# EAGLE design shrew-programmer (EAGLE 7.6.0)
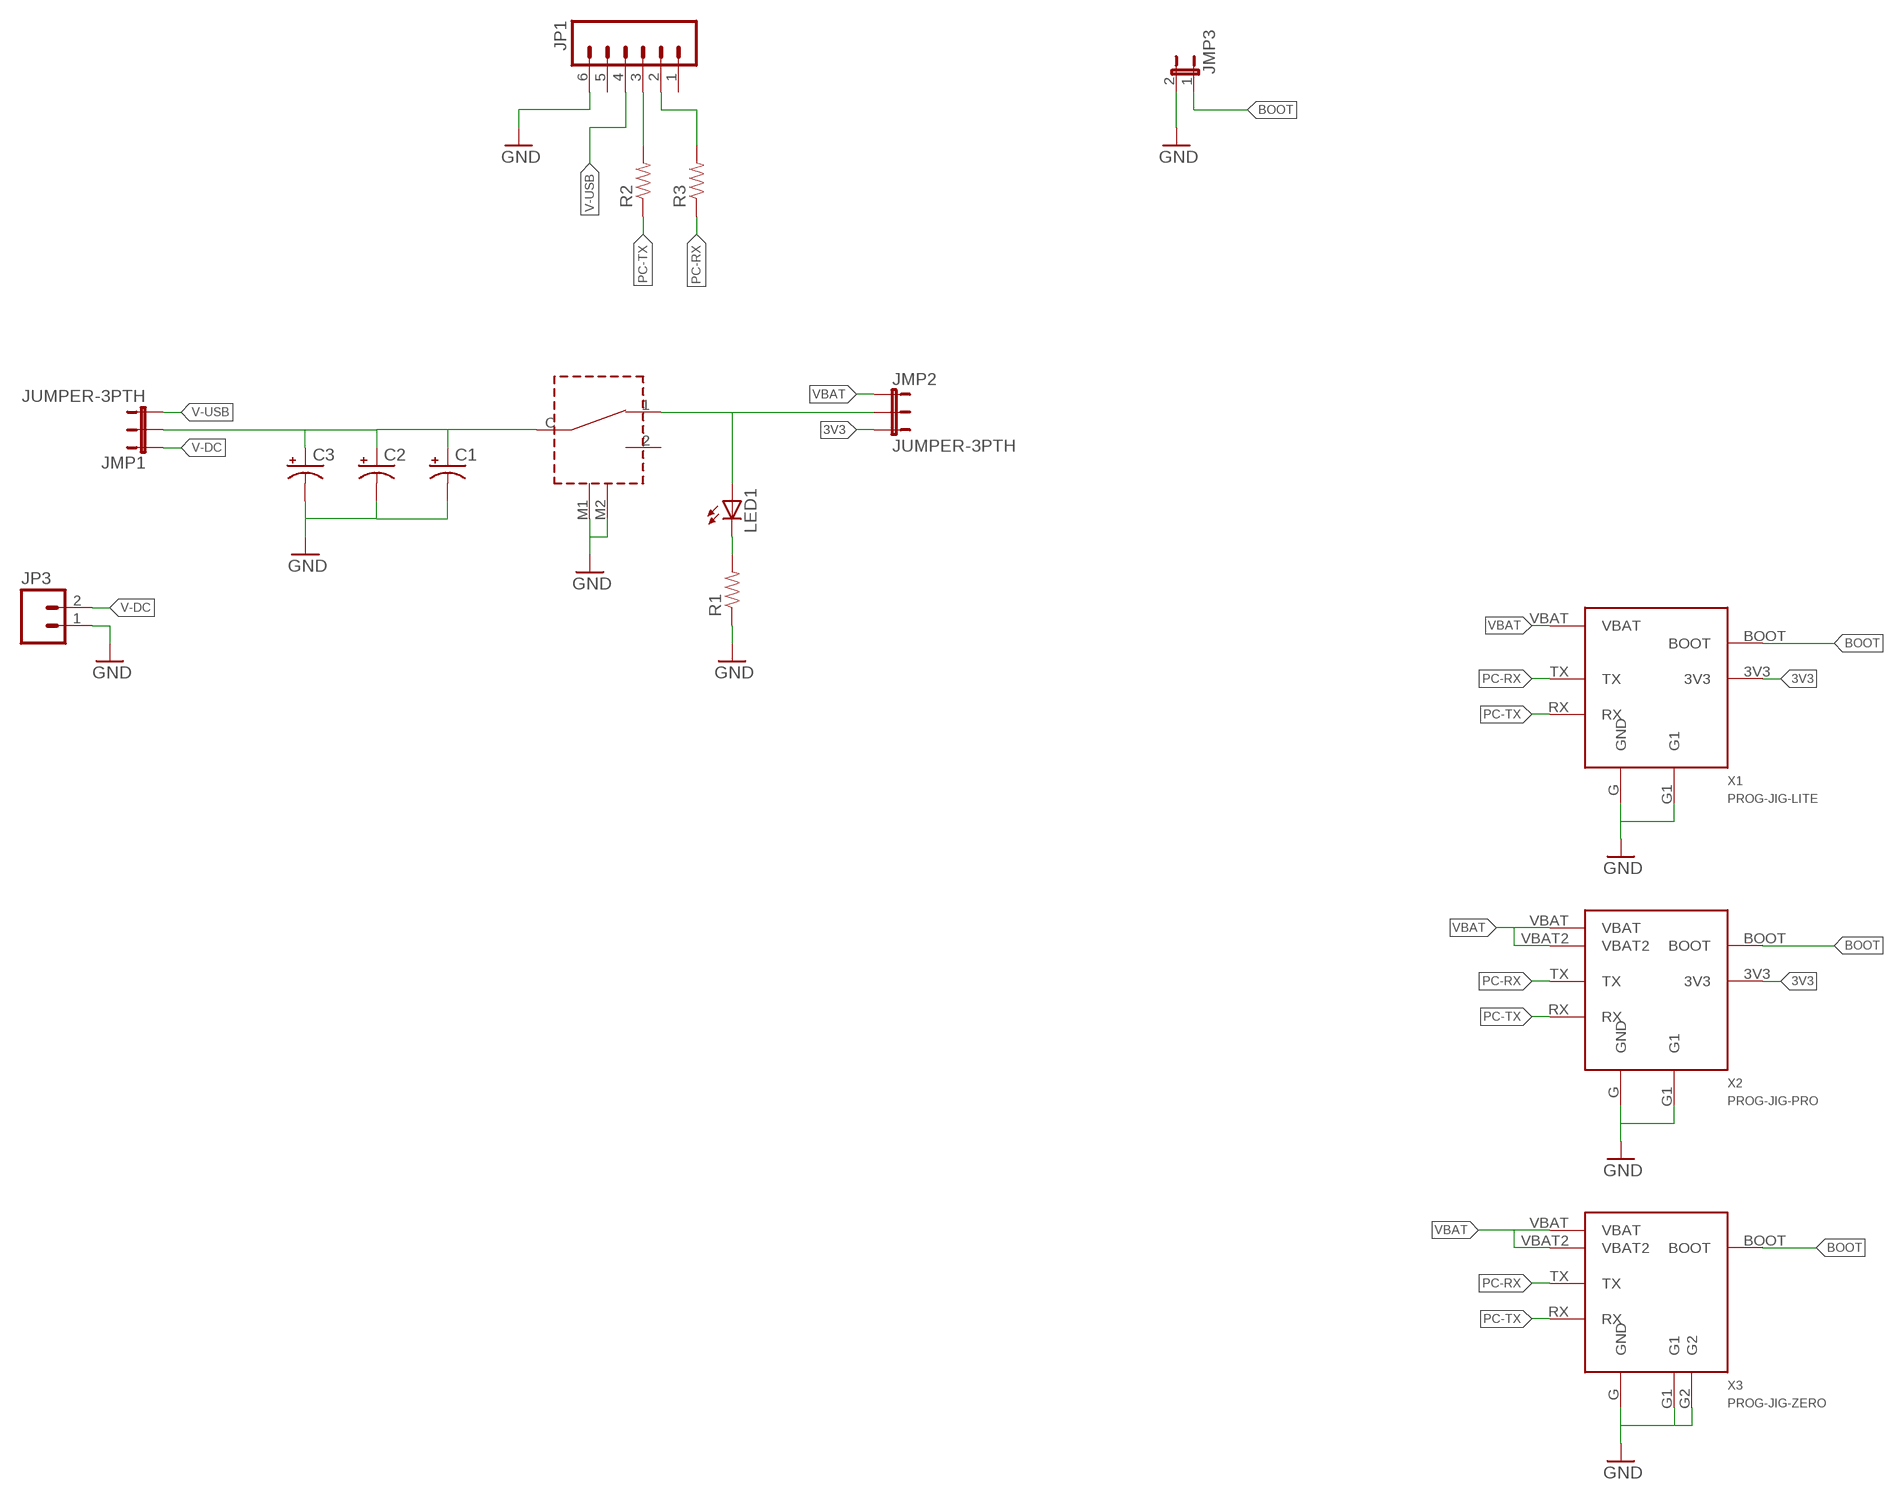
[diagram p0: schematic, sheet 1]

## Parts
C1  CAP_POLPTH1  [CPOL-RADIAL-100UF-25V]
C2  CAP_POLPTH1  [CPOL-RADIAL-100UF-25V]
C3  CAP_POLPTH1  [CPOL-RADIAL-100UF-25V]
JMP1  JUMPER-3PTH  [1X03]
JMP2  JUMPER-3PTH  [1X03]
JMP3  JUMPER-2PTH  [1X02]
JP1  M06LONGPADS  [1X06_LONGPADS]
JP3  M023.5MM  [SCREWTERMINAL-3.5MM-2]
LED1  LED1206  [LED-1206]
R1  RESISTOR0603-RES  [0603-RES]
R2  RESISTOR0603-RES  [0603-RES]
R3  RESISTOR0603-RES  [0603-RES]
SW1  SWITCH-ROCKER-3PIN-2MNT  [SWITCH-ROCKER-3PIN-2MNT]
X1  PROG-JIG-LITE  [PROG-JIG-LITE]
X2  PROG-JIG-PRO  [PROG-JIG-PRO]
X3  PROG-JIG-ZERO  [PROG-JIG-ZERO]

## Nets
3V3: JMP2.3 X1.3V3 X2.3V3
BOOT: JMP3.1 X1.BOOT X2.BOOT X3.BOOT
GND: C1.2(-) C2.2(-) C3.2(-) JMP3.2 JP1.6 JP3.1 R1.1 SW1.M1 SW1.M2 X1.G1 X1.G(GND) X2.G1 X2.G(GND) X3.G1 X3.G2 X3.G(GND)
N$1: JP1.3 R2.2
N$2: JP1.2 R3.2
N$4: C1.1(+) C2.1(+) C3.1(+) JMP1.2 SW1.C
N$5: LED1.C R1.2
N$6: JMP2.2 LED1.A SW1.1
PC-RX: R3.1 X1.TX X2.TX X3.TX
PC-TX: R2.1 X1.RX X2.RX X3.RX
V-DC: JMP1.1 JP3.2
V-USB: JMP1.3 JP1.4
VBAT: JMP2.1 X1.VBAT X2.VBAT X2.VBAT2 X3.VBAT X3.VBAT2
Unconnected: JP1.1 JP1.5 SW1.2

## Library data of the parts
C1-C3 = shrew-common:CAP_POL: Capacitor Polarized These are standard SMD and PTH capacitors. Normally 10uF, 47uF, and 100uF in electrolytic and tantalum varieties. Always verify the external diameter of the through hole cap, it varies with capacity, voltage, and manufacturer. The EIA devices should be standard.
JMP1 JMP2 = shrew-common:JUMPER-3
JMP3 = shrew-common:JUMPER-2: Jumper Basic 0.1" spaced jumper. Use with breakaway headers.
JP1 = shrew-common:M06: Header 6 Standard 6-pin 0.1" header. Use with straight break away headers (SKU : PRT-00116), right angle break away headers (PRT-00553), swiss pins (PRT-00743), machine pins (PRT-00117), and female headers (PRT-00115). Molex polarized connector foot print use with SKU : PRT-08094 with associated crimp pins and housings. NOTES ON THE VARIANTS LOCK and LOCK_LONGPADS... This footprint was designed to help hold the alignment of a through-hole component (i.e. 6-pin header) while soldering it into place. You may notice that each hole has been shifted either up or down by 0.005 of an inch from it's more standard position (which is a perfectly straight line). This slight alteration caused the pins (the squares in the middle) to touch the edges of the holes. Because they are alternating, it causes a "brace" to hold the component in place. 0.005 has proven to be the perfect amount of "off-center" position when using our standard breakaway headers. Although looks a little odd when you look at the bare footprint, once you have a header in there, the alteration is very hard to notice. Also, if you push a header all the way into place, it is covered up entirely on the bottom side. This idea of altering the position of holes to aid alignment will be further integrated into the Sparkfun Library for other footprints. It can help hold any component with 3 or more connection pins.
JP3 = shrew-common:M02: Header 2 Standard 2-pin 0.1" header. Use with straight break away headers (SKU : PRT-00116), right angle break away headers (PRT-00553), swiss pins (PRT-00743), machine pins (PRT-00117), and female headers (PRT-00115). Molex polarized connector foot print use with SKU : PRT-08233 with associated crimp pins and housings.
LED1 = shrew-common:LED: LEDs Standard schematic elements and footprints for 5mm, 3mm, 1206, and 0603 sized LEDs. 5mm - Spark Fun Electronics SKU : COM-00529 (and others)
R1-R3 = shrew-common:RESISTOR: Resistor Basic schematic elements and footprints for 0603, 1206, and PTH resistors.
SW1 = shrew-core:SWITCH-ROCKER-3PIN-2MNT
X1 = shrew-core:PROG-JIG-LITE
X2 = shrew-core:PROG-JIG-PRO
X3 = shrew-core:PROG-JIG-ZERO

## Board
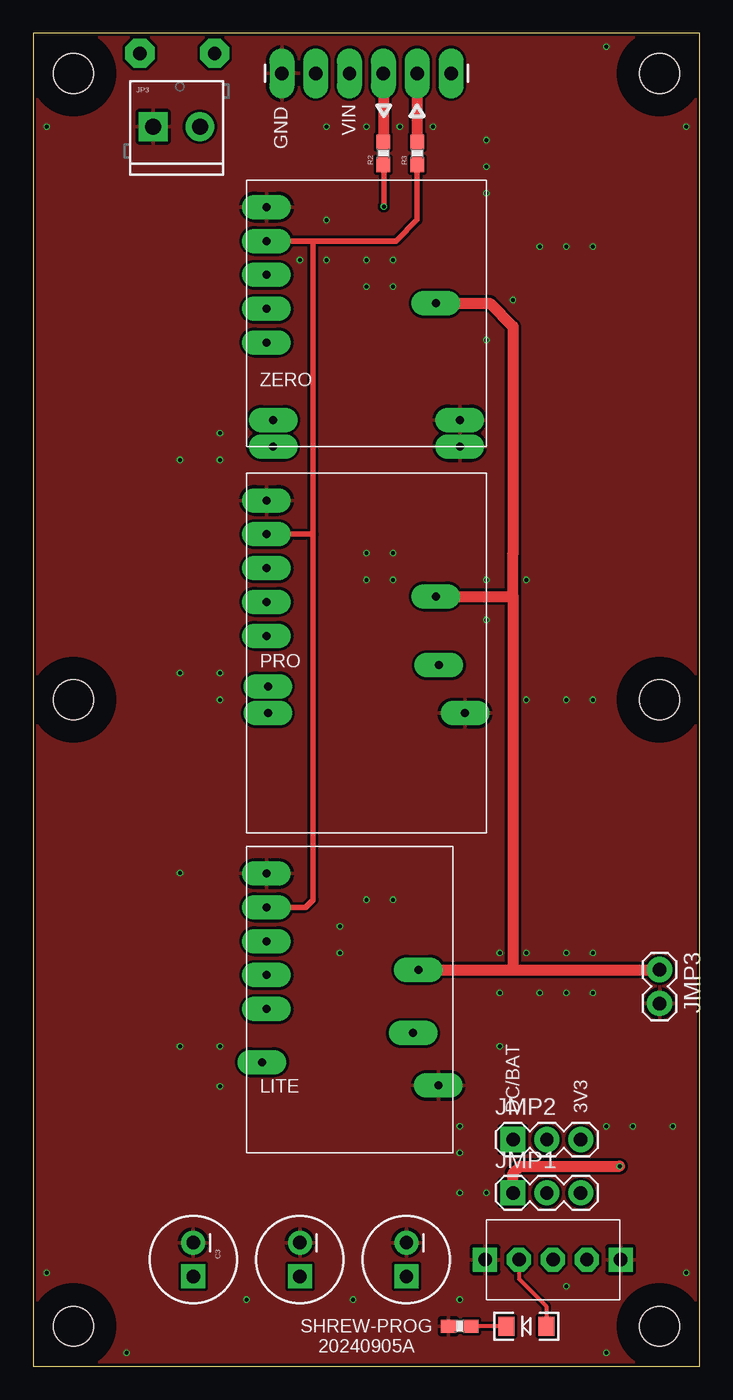
[diagram p1: board, top side]
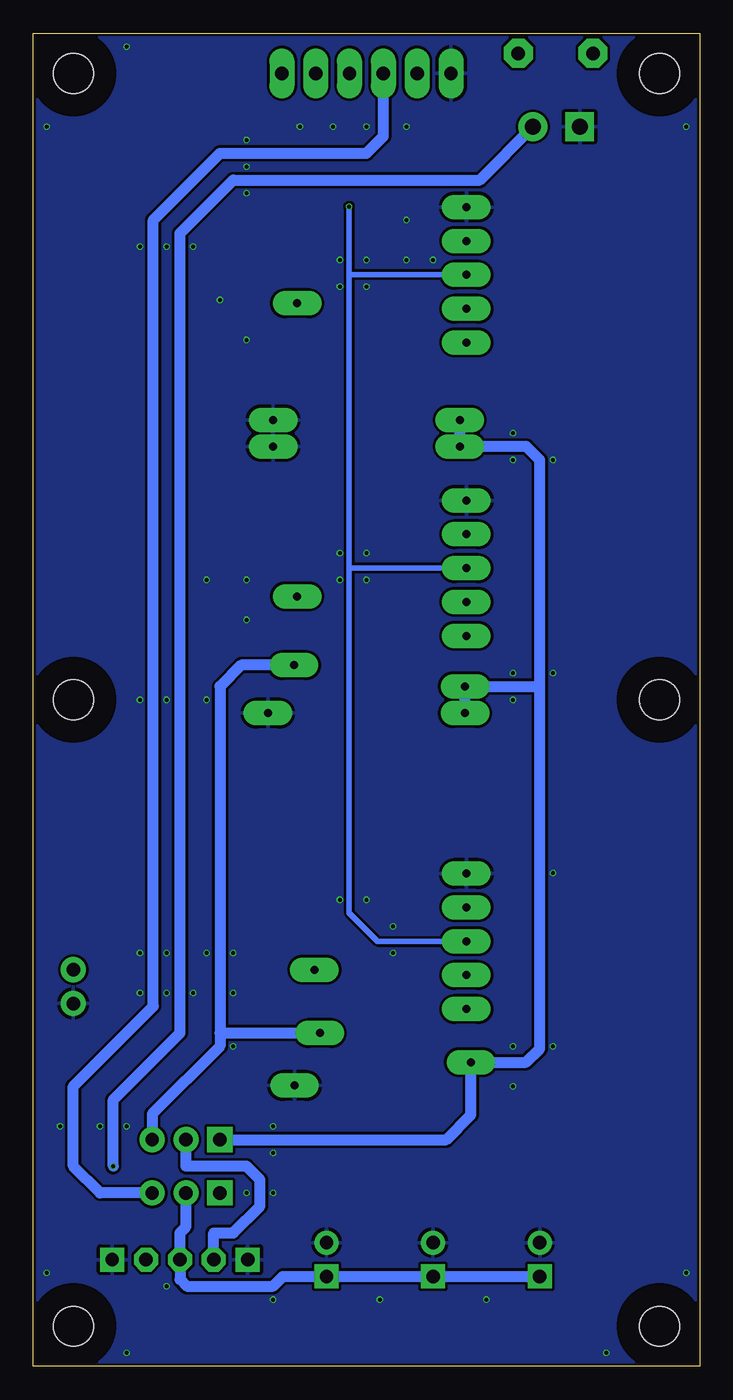
[diagram p2: board, bottom side, seen from below]

Size 50 x 100 mm. Coordinates in mm from the lower left corner, seen from the top.
Outline: 0,0 50,0 50,100 0,100 0,0
Copper layers (1*16): Top 0.035mm / dielectric 1.6mm / Bottom 0.035mm
Design rules "jlcpcb-2layers": minimum track width 5mil, minimum drill 0.3mm, track to track 5mil, track to pad 5mil, pad to pad 5mil, via to via 5mil, smd to smd 5mil, copper to edge 0.2mm, drill to drill 6mil, minimum pad ring 10mil, minimum via ring 3mil, stop-mask expansion 4mil, vias tented up to drill 0mil, thermal gap 10mil
Holes 3 mm at 3,3 47,3 47,97 3,97 3,50 47,50
tRestrict: area 0,94 to 6,100; area 0,0 to 6,6; area 44,0 to 50,6; area 44,94 to 50,100; area 0,47 to 6,53; area 44,47 to 50,53
bRestrict: area 0,94 to 6,100; area 0,0 to 6,6; area 44,0 to 50,6; area 44,94 to 50,100; area 0,47 to 6,53; area 44,47 to 50,53

### Footprints (pad centres in the part's own frame; a part is rotated, then mirrored left to right if it is on the bottom)
CPOL-RADIAL-100UF-25V = drill 1 pad 1.778 square: 1 1.27,0 | drill 1 pad 1.778: 2 -1.27,0
1X03 = drill 1 pad 1.88 square: 1 0,0 | drill 1 pad 1.88: 2 2.54,0; 3 5.08,0
1X02 = drill 1 pad 1.88: 1 0,0; 2 2.54,0
1X06_LONGPADS = drill 1 pad 1.88 long: 1 0,0; 2 2.54,0; 3 5.08,0; 4 7.62,0; 5 10.16,0; 6 12.7,0
SCREWTERMINAL-3.5MM-2 = drill 1.2 pad 2.032 square: 1 0,0 | drill 1.2 pad 2.032: 2 3.5,0
LED-1206 = smd 1.2 x 1.4: A -1.5,0; C 1.5,0
0603-RES = smd 1.1 x 1: 1 -0.85,0; 2 0.85,0
SWITCH-ROCKER-3PIN-2MNT = drill 1 octagon: 1 0,2.54; 2 0,-2.54; C 0,0 | drill 1 square: M1 0,5.088; M2 0,-5.08
PROG-JIG-LITE = drill 0.6 pad 1.829 long: 1 1.5,13.34; 2 1.5,10.8; 3V3 12.5,9; BOOT 12.9,13.75; G 1.5,20.96; G1 14.39,5.06; RX 1.5,15.88; TX 1.5,18.42; VBAT 1.16,6.8
PROG-JIG-PRO = drill 0.6 pad 1.829 long: 1 1.5,17.34; 2 1.5,14.8; 3V3 14.43,12.6; BOOT 14.2,17.75; G 1.5,24.96; G1 16.4,9; RX 1.5,19.88; TX 1.5,22.42; VBAT 1.6,11; VBAT2 1.6,9
PROG-JIG-ZERO = drill 0.6 pad 1.829 long: 1 1.5,10.34; 2 1.5,7.8; BOOT 14.2,10.75; G 1.5,17.96; G1 16,0; G2 16,2; RX 1.5,12.88; TX 1.5,15.42; VBAT 2,2; VBAT2 2,0

### Placement (x,y rotation side)
C1  28,8 270 top
C2  20,8 270 top
C3  12,8 270 top
JMP1  36,13 0 top
JMP2  36,17 0 top
JMP3  47,29.75 270 top
JP1  31.35,97 180 top
JP3  9,93 0 top
LED1  37,3 180 top
R1  32,3 0 top
R2  26.27,91 90 top
R3  28.81,91 90 top
SW1  39,8 90 top
X1  16,16 0 top
X2  16,40 0 top
X3  16,69 0 top

### Tracks (layer width: path | path; a pad name or v marks a point on that pad's centre or on a via)
3V3
  Bottom 0.813: X2.3V3 34.4,52.6 36,51 36,25 | 36,25 X1.3V3 | 36,25 36,24 41.08,18.92 JMP2.3
BOOT
  Top 0.813: X1.BOOT 36,29.75 | 36,29.75 JMP3.1 | X3.BOOT 34.25,79.75 36,78 36,61 36,57.75 | 36,57.75 36,29.75 | X2.BOOT 36,57.75
GND  (via drill 0.3)
  other vias: 1,7 7,1 43,1 49,7 45,18 43,18 48,18 32,13 34,13 32,18 32,16 35,28 38,28 40,28 42,28 37,50 40,50 42,50 38,84 40,84 42,84 34,77 34,56 34,59 11,37 14,24 14,21 14,52 14,50 14,70 14,68 20,83 22,83 22,86 25,83 27,83 27,81 25,81 25,61 27,61 27,59 25,59 25,35 27,35 23,31 23,33 35,24 34,88 34,90 34,92 30,93 27.5,93 25,93 22,93 1,93 43,99 49,93 37,59 36,80 35,31 37,31 16,5 24,5 32,5 40,6 11,24 11,68 11,52 42,31 40,31
  pour Top (isolate 0.203): 0,0 50,0 50,100 0,100
  pour Bottom (isolate 0.203): 0,0 50,0 50,100 0,100
N$1
  Top 0.813: JP1.3 R2.2
N$2
  Top 0.813: JP1.2 R3.2
N$3  (via drill 1 pad 2.18)
  other vias: 8,98.5
N$4
  Bottom 0.813: JMP1.2 38.54,10.46 39,10 SW1.C 39,6.51 38.49,6 32,6 31.27,6.73 C1.1 C2.1 C3.1
N$5
  Top 0.305: LED1.C R1.2
N$6
  Top 0.305: SW1.1 36.46,6.54 38.5,4.5 LED1.A
  Bottom 0.813: SW1.1 36.46,10 35,10 33,12 33,14 34,15 38.54,15 JMP2.2
N$7  (via drill 1 pad 2.18)
  other vias: 13.6,98.5
PC-RX
  Top 0.406: R3.1 28.81,86.01 27.22,84.42 21,84.42 | 21,84.42 X3.TX | X2.TX 21,62.42 | 21,62.42 21,84.42 | X1.TX 20.42,34.42 21,35 21,62.42
PC-TX  (via drill 0.3)
  Top 0.406: R2.1 26.3,90.12 v26.3,87
  Bottom 0.406: v26.3,87 26.3,81.88 | 26.3,81.88 26.3,59.88 | 26.3,59.88 26.3,34.02 24.16,31.88 X1.RX | X2.RX 26.3,59.88 | X3.RX 26.3,81.88
V-DC  (via drill 0.3)
  Top 0.813: JMP1.1 36,14.5 36.5,15 v44,15
  Bottom 0.813: v44,15 44,20 39,25 39,85 35,89 16.5,89 JP3.2
V-USB
  Bottom 0.813: JMP1.3 45,13 47,15 47,21 41,27 41,86 36,91 25,91 23.73,92.27 JP1.4
VBAT
  Bottom 0.813: 12,51 12,23.82 13.02,22.8 X1.VBAT 17.16,18.84 19,17 JMP2.1 | 12,51 12,68 13,69 X3.VBAT2 X3.VBAT | 12,51 X2.VBAT X2.VBAT2

### Text on the board
tPlace: VIN | GND | ZERO | PRO | LITE | DC/BAT | 3V3 | SHREW-PROG / 20240905A